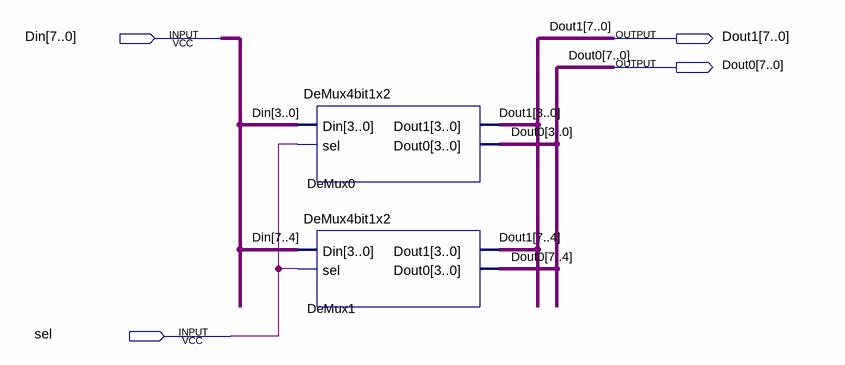
[diagram p0: schematic sheet]
// Quartus schematic DeMux8bit1x2.bdf as structural Verilog: 2 symbols, 4 pins
module DeMux8bit1x2 (
  input  [7:0] Din,
  input  sel,
  output [7:0] Dout1,
  output [7:0] Dout0
);

  DeMux4bit1x2 DeMux0 (.Din(Din[3:0]), .sel(sel), .Dout1(Dout1[3:0]), .Dout0(Dout0[3:0]));
  DeMux4bit1x2 DeMux1 (.Din(Din[7:4]), .sel(sel), .Dout1(Dout1[7:4]), .Dout0(Dout0[7:4]));
endmodule
